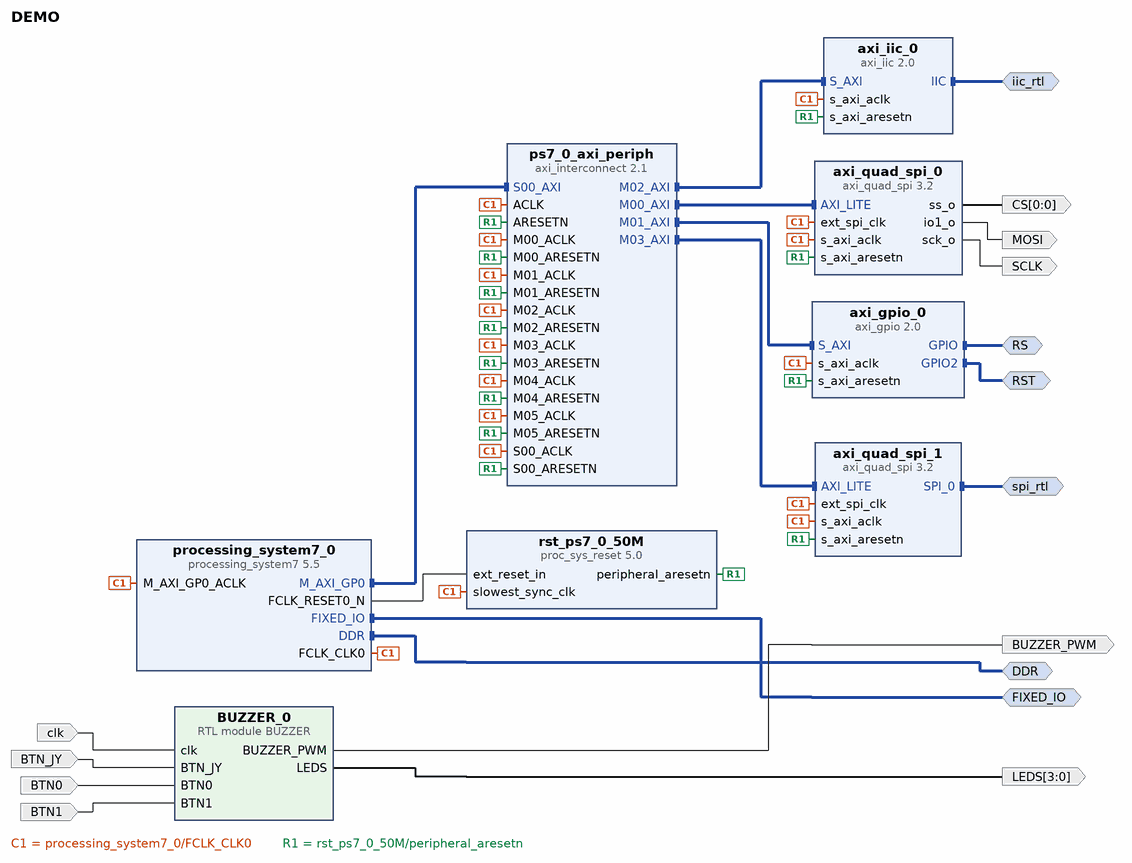
[diagram p0: block diagram of the top level]
# Vivado block design DEMO, xc7z010clg400-1, Vivado 2020.1
create_bd_design DEMO

create_bd_intf_port -mode Master -vlnv xilinx.com:interface:ddrx_rtl:1.0 DDR
create_bd_intf_port -mode Master -vlnv xilinx.com:display_processing_system7:fixedio_rtl:1.0 FIXED_IO
create_bd_intf_port -mode Master -vlnv xilinx.com:interface:gpio_rtl:1.0 RS
create_bd_intf_port -mode Master -vlnv xilinx.com:interface:gpio_rtl:1.0 RST
create_bd_intf_port -mode Master -vlnv xilinx.com:interface:spi_rtl:1.0 spi_rtl
create_bd_intf_port -mode Master -vlnv xilinx.com:interface:iic_rtl:1.0 iic_rtl
create_bd_port -dir O MOSI
create_bd_port -dir O SCLK
create_bd_port -dir O -from 0 -to 0 CS
create_bd_port -dir I -type clk clk
create_bd_port -dir I BTN_JY
create_bd_port -dir I BTN0
create_bd_port -dir I BTN1
create_bd_port -dir O -from 3 -to 0 LEDS
create_bd_port -dir O BUZZER_PWM

create_bd_cell -type ip -vlnv xilinx.com:ip:axi_interconnect:2.1 ps7_0_axi_periph
set_property -dict {CONFIG.NUM_MI 6} [get_bd_cells ps7_0_axi_periph]
create_bd_cell -type module -reference BUZZER BUZZER_0
create_bd_cell -type ip -vlnv xilinx.com:ip:axi_gpio:2.0 axi_gpio_0
set_property -dict [list \
  CONFIG.C_ALL_INPUTS 0 \
  CONFIG.C_ALL_INPUTS_2 0 \
  CONFIG.C_ALL_OUTPUTS 1 \
  CONFIG.C_ALL_OUTPUTS_2 1 \
  CONFIG.C_GPIO2_WIDTH 1 \
  CONFIG.C_GPIO_WIDTH 1 \
  CONFIG.C_IS_DUAL 1 \
  CONFIG.GPIO2_BOARD_INTERFACE Custom \
  CONFIG.GPIO_BOARD_INTERFACE Custom \
  CONFIG.USE_BOARD_FLOW true \
] [get_bd_cells axi_gpio_0]
create_bd_cell -type ip -vlnv xilinx.com:ip:axi_iic:2.0 axi_iic_0
set_property -dict {CONFIG.IIC_BOARD_INTERFACE Custom CONFIG.USE_BOARD_FLOW true} [get_bd_cells axi_iic_0]
create_bd_cell -type ip -vlnv xilinx.com:ip:axi_quad_spi:3.2 axi_quad_spi_0
set_property -dict [list \
  CONFIG.C_FIFO_DEPTH 16 \
  CONFIG.C_S_AXI4_ID_WIDTH 0 \
  CONFIG.C_USE_STARTUP 0 \
  CONFIG.FIFO_INCLUDED 1 \
] [get_bd_cells axi_quad_spi_0]
create_bd_cell -type ip -vlnv xilinx.com:ip:axi_quad_spi:3.2 axi_quad_spi_1
set_property -dict [list \
  CONFIG.C_NUM_TRANSFER_BITS 16 \
  CONFIG.C_SCK_RATIO 16 \
  CONFIG.C_S_AXI4_ID_WIDTH 0 \
  CONFIG.C_USE_STARTUP 0 \
  CONFIG.Multiples16 2 \
] [get_bd_cells axi_quad_spi_1]
create_bd_cell -type ip -vlnv xilinx.com:ip:processing_system7:5.5 processing_system7_0
set_property -dict [list \
  CONFIG.PCW_APU_PERIPHERAL_FREQMHZ 666.666666 \
  CONFIG.PCW_ENET0_ENET0_IO {MIO 16 .. 27} \
  CONFIG.PCW_ENET0_GRP_MDIO_ENABLE 1 \
  CONFIG.PCW_ENET0_GRP_MDIO_IO {MIO 52 .. 53} \
  CONFIG.PCW_ENET0_PERIPHERAL_ENABLE 1 \
  CONFIG.PCW_ENET0_RESET_ENABLE 0 \
  CONFIG.PCW_ENET_RESET_ENABLE 1 \
  CONFIG.PCW_ENET_RESET_SELECT {Share reset pin} \
  CONFIG.PCW_FPGA0_PERIPHERAL_FREQMHZ 100 \
  CONFIG.PCW_FPGA1_PERIPHERAL_FREQMHZ 50 \
  CONFIG.PCW_GPIO_MIO_GPIO_ENABLE 1 \
  CONFIG.PCW_GPIO_MIO_GPIO_IO MIO \
  CONFIG.PCW_I2C_RESET_ENABLE 1 \
  CONFIG.PCW_PERIPHERAL_BOARD_PRESET part0 \
  CONFIG.PCW_PRESET_BANK1_VOLTAGE {LVCMOS 1.8V} \
  CONFIG.PCW_QSPI_GRP_FBCLK_ENABLE 1 \
  CONFIG.PCW_QSPI_GRP_FBCLK_IO {MIO 8} \
  CONFIG.PCW_QSPI_GRP_SINGLE_SS_ENABLE 1 \
  CONFIG.PCW_QSPI_GRP_SINGLE_SS_IO {MIO 1 .. 6} \
  CONFIG.PCW_QSPI_PERIPHERAL_ENABLE 1 \
  CONFIG.PCW_QSPI_QSPI_IO {MIO 1 .. 6} \
  CONFIG.PCW_SD0_GRP_CD_ENABLE 1 \
  CONFIG.PCW_SD0_GRP_CD_IO {MIO 47} \
  CONFIG.PCW_SD0_GRP_WP_ENABLE 0 \
  CONFIG.PCW_SD0_PERIPHERAL_ENABLE 1 \
  CONFIG.PCW_SD0_SD0_IO {MIO 40 .. 45} \
  CONFIG.PCW_SDIO_PERIPHERAL_FREQMHZ 50 \
  CONFIG.PCW_SINGLE_QSPI_DATA_MODE x4 \
  CONFIG.PCW_UART1_PERIPHERAL_ENABLE 1 \
  CONFIG.PCW_UART1_UART1_IO {MIO 48 .. 49} \
  CONFIG.PCW_UART_PERIPHERAL_FREQMHZ 100 \
  CONFIG.PCW_UIPARAM_DDR_FREQ_MHZ 533.333333 \
  CONFIG.PCW_UIPARAM_DDR_MEMORY_TYPE {DDR 3 (Low Voltage)} \
  CONFIG.PCW_UIPARAM_DDR_PARTNO {MT41K256M16 RE-125} \
  CONFIG.PCW_USB0_PERIPHERAL_ENABLE 1 \
  CONFIG.PCW_USB0_RESET_ENABLE 1 \
  CONFIG.PCW_USB0_RESET_IO {MIO 46} \
  CONFIG.PCW_USB0_USB0_IO {MIO 28 .. 39} \
  CONFIG.PCW_USB_RESET_ENABLE 1 \
  CONFIG.PCW_USB_RESET_SELECT {Share reset pin} \
] [get_bd_cells processing_system7_0]
# 503 more settings of processing_system7_0 are not shown: defaults, MIO pin electricals, DDR timing, and values the tool derives
create_bd_cell -type ip -vlnv xilinx.com:ip:proc_sys_reset:5.0 rst_ps7_0_50M

# ---- connections ----

connect_bd_intf_net [get_bd_intf_pins processing_system7_0/M_AXI_GP0] [get_bd_intf_pins ps7_0_axi_periph/S00_AXI]
connect_bd_intf_net [get_bd_intf_ports RST] [get_bd_intf_pins axi_gpio_0/GPIO2]
connect_bd_intf_net [get_bd_intf_ports FIXED_IO] [get_bd_intf_pins processing_system7_0/FIXED_IO]
connect_bd_intf_net [get_bd_intf_ports iic_rtl] [get_bd_intf_pins axi_iic_0/IIC]
connect_bd_intf_net [get_bd_intf_ports spi_rtl] [get_bd_intf_pins axi_quad_spi_1/SPI_0]
connect_bd_intf_net [get_bd_intf_pins ps7_0_axi_periph/M02_AXI] [get_bd_intf_pins axi_iic_0/S_AXI]
connect_bd_intf_net [get_bd_intf_ports RS] [get_bd_intf_pins axi_gpio_0/GPIO]
connect_bd_intf_net [get_bd_intf_pins ps7_0_axi_periph/M00_AXI] [get_bd_intf_pins axi_quad_spi_0/AXI_LITE]
connect_bd_intf_net [get_bd_intf_ports DDR] [get_bd_intf_pins processing_system7_0/DDR]
connect_bd_intf_net [get_bd_intf_pins ps7_0_axi_periph/M03_AXI] [get_bd_intf_pins axi_quad_spi_1/AXI_LITE]
connect_bd_intf_net [get_bd_intf_pins ps7_0_axi_periph/M01_AXI] [get_bd_intf_pins axi_gpio_0/S_AXI]
connect_bd_net [get_bd_pins axi_quad_spi_0/io1_o] [get_bd_ports MOSI]
connect_bd_net [get_bd_pins axi_quad_spi_0/sck_o] [get_bd_ports SCLK]
connect_bd_net [get_bd_pins axi_quad_spi_0/ss_o] [get_bd_ports CS]
connect_bd_net [get_bd_pins processing_system7_0/FCLK_CLK0] \
  [get_bd_pins ps7_0_axi_periph/S00_ACLK] [get_bd_pins ps7_0_axi_periph/M00_ACLK] [get_bd_pins ps7_0_axi_periph/ACLK] \
  [get_bd_pins ps7_0_axi_periph/M01_ACLK] [get_bd_pins ps7_0_axi_periph/M02_ACLK] [get_bd_pins ps7_0_axi_periph/M03_ACLK] \
  [get_bd_pins ps7_0_axi_periph/M04_ACLK] [get_bd_pins ps7_0_axi_periph/M05_ACLK] [get_bd_pins axi_gpio_0/s_axi_aclk] \
  [get_bd_pins axi_iic_0/s_axi_aclk] [get_bd_pins axi_quad_spi_0/ext_spi_clk] [get_bd_pins axi_quad_spi_0/s_axi_aclk] \
  [get_bd_pins axi_quad_spi_1/ext_spi_clk] [get_bd_pins axi_quad_spi_1/s_axi_aclk] \
  [get_bd_pins processing_system7_0/M_AXI_GP0_ACLK] [get_bd_pins rst_ps7_0_50M/slowest_sync_clk]
connect_bd_net [get_bd_pins processing_system7_0/FCLK_RESET0_N] [get_bd_pins rst_ps7_0_50M/ext_reset_in]
connect_bd_net [get_bd_pins rst_ps7_0_50M/peripheral_aresetn] \
  [get_bd_pins ps7_0_axi_periph/S00_ARESETN] [get_bd_pins ps7_0_axi_periph/M00_ARESETN] \
  [get_bd_pins ps7_0_axi_periph/ARESETN] [get_bd_pins ps7_0_axi_periph/M01_ARESETN] \
  [get_bd_pins ps7_0_axi_periph/M02_ARESETN] [get_bd_pins ps7_0_axi_periph/M03_ARESETN] \
  [get_bd_pins ps7_0_axi_periph/M04_ARESETN] [get_bd_pins ps7_0_axi_periph/M05_ARESETN] \
  [get_bd_pins axi_gpio_0/s_axi_aresetn] [get_bd_pins axi_iic_0/s_axi_aresetn] [get_bd_pins axi_quad_spi_0/s_axi_aresetn] \
  [get_bd_pins axi_quad_spi_1/s_axi_aresetn]
connect_bd_net -net clk_0_1 [get_bd_ports clk] [get_bd_pins BUZZER_0/clk]
connect_bd_net -net BTN_JY_0_1 [get_bd_ports BTN_JY] [get_bd_pins BUZZER_0/BTN_JY]
connect_bd_net -net BTN0_0_1 [get_bd_ports BTN0] [get_bd_pins BUZZER_0/BTN0]
connect_bd_net -net BTN1_0_1 [get_bd_ports BTN1] [get_bd_pins BUZZER_0/BTN1]
connect_bd_net [get_bd_pins BUZZER_0/LEDS] [get_bd_ports LEDS]
connect_bd_net [get_bd_pins BUZZER_0/BUZZER_PWM] [get_bd_ports BUZZER_PWM]

# ---- address map ----
assign_bd_address -offset 0x41200000 -range 64K -target_address_space [get_bd_addr_spaces processing_system7_0/Data] [get_bd_addr_segs axi_gpio_0/S_AXI/Reg]
assign_bd_address -offset 0x41600000 -range 64K -target_address_space [get_bd_addr_spaces processing_system7_0/Data] [get_bd_addr_segs axi_iic_0/S_AXI/Reg]
assign_bd_address -offset 0x41E00000 -range 64K -target_address_space [get_bd_addr_spaces processing_system7_0/Data] [get_bd_addr_segs axi_quad_spi_0/AXI_LITE/Reg]
assign_bd_address -offset 0x41E10000 -range 64K -target_address_space [get_bd_addr_spaces processing_system7_0/Data] [get_bd_addr_segs axi_quad_spi_1/AXI_LITE/Reg]

validate_bd_design
save_bd_design
